# Altium schematic sheet Schematic of Schematics.SCHDOC
size A4; Rule: RULEKIND{}RoutingVias[]NETSCOPE{}DifferentNets[]LAYERKIND{}SameLayer[]NAME{}Schematic Routing Via Style[]HOLEWIDTH{}28mil[]WIDTH{}50mil[]VIASTYLE{}Through Hole[]MINHOLEWIDTH{}10mil[]MINWIDTH{}20mil[]MAXHOLEWIDTH{}28mil[]MAXWIDTH{}50mil
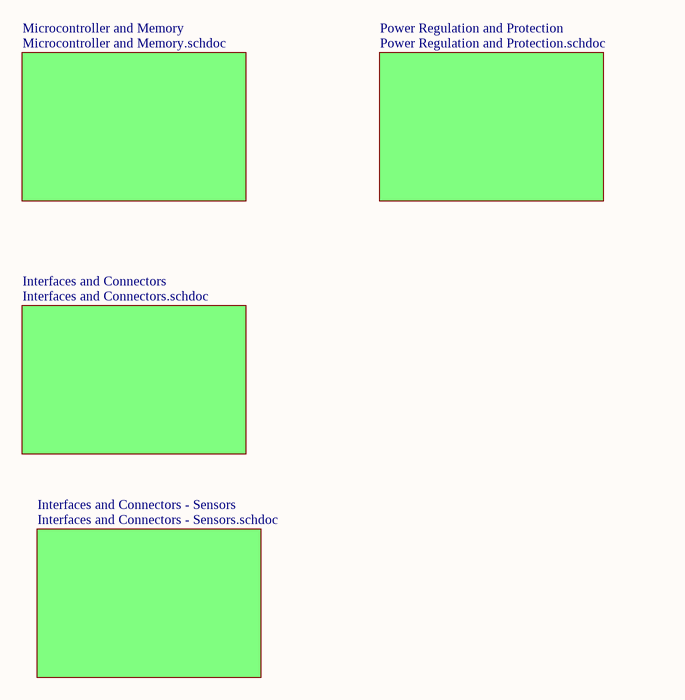
[diagram p0: Schematic of Schematics.SCHDOC]

## Sub-sheets
Interfaces and Connectors = Interfaces and Connectors.schdoc: no entries
Interfaces and Connectors - Sensors = Interfaces and Connectors - Sensors.schdoc: no entries
Microcontroller and Memory = Microcontroller and Memory.schdoc: no entries
Power Regulation and Protection = Power Regulation and Protection.schdoc: no entries